# EasyEDA Pro project e_oct_dice_Dec_2022.eprj, board e_oct_dice_pcb_v0_2_alpha
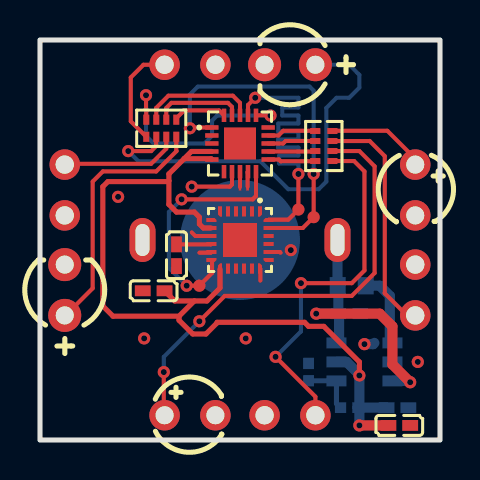
[diagram p7: board, top side]
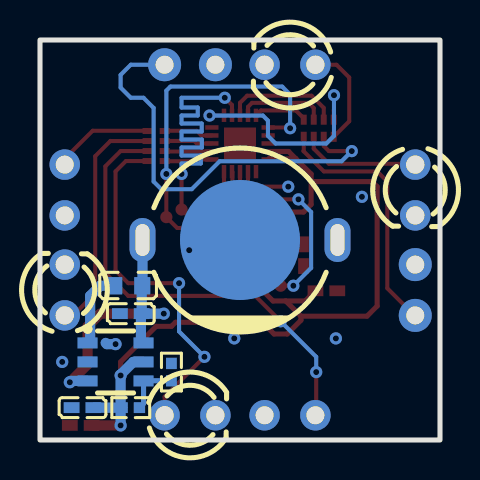
[diagram p8: board, bottom side, seen from below]

Outline 20 x 20 mm; copper layers: Top Layer, Bottom Layer. Coordinates in mm from the lower left corner of the outline.
Outline path: rectangle 0,20 20,0
Stack: Top Layer 0.035mm / Dielectric1 1.51mm FR4 er 4.5 / Bottom Layer 0.035mm

## Design rules (mm)
net LED_DEN: LED
net LED_CYR: LED
net LED_GEO: LED
net LED_WLD: LED
net LED_PYR: LED
net LED_HYD: LED
net LED_ANE: LED
net LED_ELE: LED
spacing safeClearance (default): track to track 0.152, other pairs 0.152 to 0.3
track width trackWidth (default): min 0.127, default 0.203, max 2.54
differential pair differentialPair (default): width min 0.127, default 0.254, max 2.54; gap min 0.152, default 0.152
via viaSize (default): diameter min 0.5, default 0.61, max 10; hole min 0.3, default 0.305, max 6

## Placement (name value [footprint] x y rotation side)
BT1  MY-927-01  [BAT-TH_MY-927-01]  10 10 180 bottom
C1  4.7uF  [C0402]  15.46 6.32 0 bottom
C2  4.7nF  [C0402]  17.87 1.62 180 bottom
C3  100nF  [C0402_NEW]  6.82 9.24 270 top
C4  10nF  [C0402]  17.96 0.73 0 top
C5  100nF  [C0402_NEW]  5.68 7.46 180 top
L1  4.7uH  [L0603]  15.59 7.71 180 bottom
LED1  204-10SURD/S530-A3-L  [LED-TH_BD3.0-P2.54-FD]  7.5 18.76 0 bottom
LED2  204-10SUBC/S400-A4  [LED-TH_BD4.0-P2.54-FD]  12.5 18.76 180 top
LED3  204-10SUGD/S400-A5  [LED-TH_BD3.0-P2.54-FD]  1.24 12.5 270 bottom
LED4  204-10SUBC/S400-A4  [LED-TH_BD4.0-P2.54-FD]  1.24 7.5 90 top
LED5  204-10SYGD/S530-E3-L  [LED-TH_BD3.0-P2.54-FD]  12.5 1.24 180 bottom
LED6  XL-302UWC  [LED-TH_BD3.8-P2.54-FD_WHITE]  7.5 1.24 0 top
LED7  TJ-L3FYTXHAMCGLFLC0A-A5  [LED-TH_BD3.0-P2.54-FD]  18.76 7.5 90 bottom
LED8  XL-302UWC  [LED-TH_BD3.8-P2.54-FD_WHITE]  18.76 12.5 270 top
NOREF  -  [Pad_e193]  10 12.67 0 top
NOREF#2  -  [Pad_e513]  13.68 11.14 0 top
NOREF#3  -  [Pad_e514]  12.92 11.52 0 top
NOREF#4  -  [Pad_e516]  7.97 7.71 0 top
NOREF#5  -  [Pad_e199]  10.38 12.67 0 top
PR1  TPS61070DDCR  [SOT-23-6_L2.9-W1.6-P0.95-LS2.8-BR]  16.22 3.9 0 bottom
R1  1MΩ  [R0402]  15.46 1.62 0 bottom
R2  180kΩ  [R0402]  13.43 3.4 270 bottom
RN1  220Ω  [RES-ARRAY-SMD_0402-8P-L2.0-W1.0-BL]  6.06 15.59 0 top
RN2  220Ω  [RES-ARRAY-SMD_0402-8P-L2.0-W1.0-BL]  14.19 14.7 90 top
U1  STC8G1K08-38I-QFN20  [TQFN-20L_L3.0-W3.0-P0.40-BL-EP]  10 14.83 270 top
U2  MPU6500  [QFN-24_L3.0-W3.0-P0.40-BL-EP]  10 10 180 top

## Footprints (pads in the part's own frame, mm; a bottom-side part is the same pattern mirrored in y, then rotated)
BAT-TH_MY-927-01
  oval 1.3x2.2 hole 0.701x1.6: 1(-4.875,0) 1(4.875,0)
  round 6 smd: 2(0,0)
C0402
  rect 0.79x0.54 smd: 1(-0.545,0) 2(0.545,0)
C0402_NEW
  rect 0.79x0.54 smd: 1(-0.545,0) 2(0.545,0)
L0603
  rect 0.8x0.864 smd: 1(-0.7,0) 2(0.7,0)
LED-TH_BD3.0-P2.54-FD
  round 1.524 hole 0.914: 1(-1.27,0) 2(1.27,0)
LED-TH_BD3.8-P2.54-FD_WHITE
  round 1.524 hole 0.9: 1(-1.27,0) 2(1.27,0)
LED-TH_BD4.0-P2.54-FD
  round 1.651 hole 0.9: 1(-1.27,0) 2(1.27,0)
Pad_e193
  custom 0.127x0.381 smd: 1(0,0)
Pad_e199
  custom 0.127x0.381 smd: 2(0,0)
Pad_e513
  round 0.61 smd: TP1(0,0)
Pad_e514
  round 0.61 smd: TP2(0,0)
Pad_e516
  round 0.61 smd: TP3(0,0)
QFN-24_L3.0-W3.0-P0.40-BL-EP
  custom 0.2x0.506 smd: 1(-1,-1.427) 6(1,-1.427) 13(1,1.427) 18(-1,1.427)
  rect 0.2x0.505 smd: 2(-0.6,-1.427) 3(-0.2,-1.427) 4(0.2,-1.427) 5(0.6,-1.427) 14(0.6,1.427) 15(0.2,1.427) 16(-0.2,1.427) 17(-0.6,1.427)
  custom 0.506x0.2 smd: 7(1.427,-1) 12(1.427,1) 19(-1.427,1) 24(-1.427,-1)
  rect 0.505x0.2 smd: 8(1.427,-0.6) 9(1.427,-0.2) 10(1.427,0.2) 11(1.427,0.6) 20(-1.427,0.6) 21(-1.427,0.2) 22(-1.427,-0.2) 23(-1.427,-0.6)
  rect 1.7x1.7 smd: 25(0,0)
R0402
  rect 0.566x0.54 smd: 1(-0.433,0) 2(0.433,0)
RES-ARRAY-SMD_0402-8P-L2.0-W1.0-BL
  rect 0.3x0.505 smd: 1(-0.75,0.427) 2(-0.25,0.427) 3(0.25,0.427) 4(0.75,0.427) 5(0.75,-0.427) 6(0.25,-0.427) 7(-0.25,-0.427) 8(-0.75,-0.427)
SOT-23-6_L2.9-W1.6-P0.95-LS2.8-BR
  rect 1x0.55 smd: 1(1.4,-0.95) 2(1.4,0) 3(1.4,0.95) 4(-1.4,0.95) 5(-1.4,0) 6(-1.4,-0.95)
TQFN-20L_L3.0-W3.0-P0.40-BL-EP
  rect 0.224x0.665 smd: 1(-0.8,-1.407) 2(-0.4,-1.407) 3(0,-1.407) 4(0.4,-1.407) 5(0.8,-1.407) 11(0.8,1.407) 12(0.4,1.407) 13(0,1.407) 14(-0.4,1.407) 15(-0.8,1.407)
  rect 0.665x0.224 smd: 6(1.407,-0.8) 7(1.407,-0.4) 8(1.407,0) 9(1.407,0.4) 10(1.407,0.8) 16(-1.407,0.8) 17(-1.407,0.4) 18(-1.407,0) 19(-1.407,-0.4) 20(-1.407,-0.8)
  rect 1.6x1.6 smd: 21(0,0)

## Nets
GND: BT1.2 C1.2 C2.1 C3.2 C4.2 C5.2 LED1.2 LED2.2 LED3.2 LED4.2 LED5.2 LED6.2 LED7.2 LED8.2 PR1.2 R2.1 U1.7 U2.9 U2.11 U2.18 U2.20
VBAT: C1.1 L1.2 PR1.3 PR1.6
VCC: C2.2 C4.1 C5.1 PR1.5 R1.2 U1.4 U1.5 U2.8 U2.13
LED_ANE: RN1.3 U1.19
LED_CYR: RN2.2 U1.12
LED_DEN: RN2.1 U1.11
LED_ELE: RN1.4 U1.20
LED_GEO: RN2.3 U1.13
LED_HYD: RN1.2 U1.18
LED_PYR: RN1.1 U1.16
LED_WLD: RN2.4 U1.14
MPU_INT: NOREF#4.TP3 U1.10 U2.12
MPU_SCL: NOREF#2.TP1 U1.1 U2.23
MPU_SDA: NOREF#3.TP2 U1.17 U2.24
RX: NOREF.1 U1.8
TX: NOREF#5.2 U1.9
$1N1768: L1.1 PR1.1
$1N1911: PR1.4 R1.1 R2.2
$1N2923: C3.1 U2.10
$1N6086: LED5.1 RN2.8
$1N6099: LED6.1 RN2.7
$1N6112: LED7.1 RN2.6
$1N6141: LED8.1 RN2.5
$1N6202: LED1.1 RN1.8
$1N6215: LED2.1 RN1.7
$1N6228: LED3.1 RN1.6
$1N6241: LED4.1 RN1.5

Pads without a net: BT1 1; U1 2 3 6 15 21; U2 1 2 3 4 5 6 7 14 15 16 17 19 21 22 25

## Via types
v1: diameter 0.61, hole 0.305, Top Layer to Bottom Layer, 22 vias
v2: diameter 0.61, hole 0.304, Top Layer to Bottom Layer, 2 vias

## Routing (per net, layer and track width the routed paths; a pad name or vN(x,y) marks a point on that pad's centre or on a via; arc(x,y) is an arc through that point)
GND: length 6.1
  Top Layer w0.203: U2.11 8.54,9.36 7.97,9.36 ; U2.18 11.02,8.56 11.02,7.97 ; 12.03,9.36 12,9.4 U2.20 ; U1.7 9.6,12.78 9.49,12.67 v1(7.59,12.67) ; U2.9 7.77,10.2 7.59,10.38
  Bottom Layer w0.508: v1(16.22,4.79) 16.66,4.79 16.72,4.85
  vias: v1(3.9,12.16) v1(12.54,9.49) v1(18.89,3.9) v2(5.21,5.08) v2(10.29,5.08)
VBAT: length 14.5
  Top Layer w0.508: v1(18.51,2.89) 17.62,3.78 17.62,5.68 16.99,6.32 v1(13.81,6.32)
  Bottom Layer w0.508: 14.87,10 14.87,7.73 L1.2 14.92,7.69 C1.1 ; v1(18.51,2.89) 18.44,2.95 PR1.3 ; C1.1 14.95,6.28 14.95,4.98 PR1.6 ; C1.1 v1(13.81,6.32)
VCC: length 45.2
  Top Layer w0.254: v1(15.97,3.23) 15.97,3.9 14.19,5.68 13.43,5.68 13.23,5.89 8.86,5.89 8.86,5.86 8.3,5.3 7.64,5.3 6.95,5.99 6.95,6.19 ; U1.4 7.57,14.43 7.21,14.06 ; U2.13 9,7.6 8.35,6.95 7.71,6.95 ; 7.21,14.06 8.55,14.06 U1.5 ; 7.21,14.06 6.44,13.3 6.44,12.96 ; 6.95,6.19 7.71,6.95 ; 6.95,6.19 3.65,6.19 3.14,6.7 3.14,12.67 3.4,12.92 6.4,12.92 6.44,12.96 ; 7.71,6.95 6.74,6.95 6.23,7.46 ; 6.44,12.96 6.44,11.78 6.82,11.4 7.71,11.4 7.97,11.14 7.97,10.8 8.17,10.6 U2.8
  Top Layer w0.508: v1(15.97,0.73) C4.1
  Bottom Layer w0.508: v1(15.97,0.73) 15.97,1.54 R1.2 ; R1.2 C2.2 ; R1.2 15.97,1.69 15.97,3.27 15.33,3.9 PR1.5
LED_ANE: length 4.5
  Top Layer w0.203: U1.19 9.6,16.66 9.4,16.86 6.57,16.86 6.31,16.6 RN1.3
LED_CYR: length 2.4
  Top Layer w0.203: U1.12 13.74,14.43 RN2.2
LED_DEN: length 2.4
  Top Layer w0.203: RN2.1 13.75,13.94 12.03,13.94 11.94,14.03 U1.11
LED_ELE: length 2.7
  Top Layer w0.203: U1.20 8.96,16.48 7.21,16.48 6.81,16.08 RN1.4
LED_GEO: length 2.4
  Top Layer w0.203: RN2.3 13.76,14.95 12.29,14.95 12.16,14.83 U1.13
LED_HYD: length 5.8
  Top Layer w0.203: RN1.2 5.81,16.61 6.42,17.21 9.64,17.21 10,16.86 U1.18
LED_PYR: length 11.4
  Top Layer w0.203: v1(5.3,17.24) 5.3,16.48 5.31,16.47 RN1.1 ; v1(11.52,16.22) 11.51,16.23 U1.16
  Bottom Layer w0.203: v1(11.52,16.22) 8.86,16.22 8.6,15.97 8.6,15.21 8.22,14.83 5.68,14.83 5.3,15.21 v1(5.3,17.24)
LED_WLD: length 2.5
  Top Layer w0.203: U1.14 11.92,15.23 12.16,15.46 13.75,15.46 RN2.4
MPU_INT: length 12.2
  Top Layer w0.203: U1.10 10.8,12.2 10.63,12.03 v1(7.08,12.03) ; U2.12 8.6,8.97 8.6,8.35 NOREF#4.TP3 v1(7.33,7.71)
  Bottom Layer w0.203: v1(7.33,7.71) 6.44,8.6 6.44,11.4 v1(7.08,12.03)
MPU_SCL: length 18.1
  Top Layer w0.203: U1.1 7.53,15.63 v1(7.5,15.59) ; v1(13.68,13.3) NOREF#2.TP1 13.14,10.6 U2.23
  Bottom Layer w0.203: v1(7.5,15.59) 7.5,17.2 7.46,17.24 7.89,17.67 13.48,17.67 13.68,17.47 v1(13.68,13.3)
MPU_SDA: length 18.1
  Top Layer w0.203: U2.24 11.44,11.02 12.41,11.02 NOREF#3.TP2 v1(12.92,13.3) ; v1(10.76,17.11) 10.4,16.75 U1.17
  Bottom Layer w0.203: v1(10.76,17.11) 12.92,17.11 12.92,16.62 12.11,16.62 12.11,16.22 12.92,16.22 12.92,15.82 11.91,15.82 11.91,15.42 12.92,15.42 12.92,15.02 11.91,15.02 11.91,14.62 12.92,14.62 12.92,14.22 11.96,14.22 11.96,13.82 12.92,13.82 v1(12.92,13.3)
RX: length 0.8
  Top Layer w0.203: U1.8 NOREF.1
TX: length 0.8
  Top Layer w0.203: NOREF#5.2 10.38,13.4 U1.9
$1N1768: length 3.8
  Bottom Layer w0.508: L1.1 16.99,7.71 17.49,7.21 17.49,4.98 PR1.1
$1N1911: length 2.8
  Bottom Layer w0.254: R1.1 14.82,1.82 PR1.4 14.81,2.96 R2.2
$1N2923: length 1.8
  Top Layer w0.203: U2.10 8.56,9.78 C3.1
$1N6086: length 18.2
  Top Layer w0.203: RN2.8 15.7,13.95 16.22,13.43 16.22,8.48 15.59,7.84 v1(13.05,7.84) ; v1(11.78,4.16) 13.77,2.17 LED5.1
  Bottom Layer w0.203: v1(13.05,7.84) 13.05,5.43 v1(11.78,4.16)
$1N6099: length 23
  Top Layer w0.203: v1(7.97,5.94) 9.24,7.21 15.59,7.21 16.73,8.35 16.73,13.68 15.97,14.45 RN2.7 ; v1(6.19,3.4) 6.19,1.28 LED6.1
  Bottom Layer w0.203: v1(7.97,5.94) 6.19,4.16 v1(6.19,3.4)
$1N6112: length 11.8
  Top Layer w0.203: RN2.6 16.47,14.95 16.48,14.95 17.24,14.19 17.24,7.33 18.34,6.23 LED7.1
$1N6141: length 5
  Top Layer w0.203: 18.77,13.77 18.77,14.06 17.37,15.46 14.63,15.46 RN2.5
$1N6202: length 5.1
  Top Layer w0.203: RN1.8 4.54,15.93 4.54,18.13 5.17,18.76 6.12,18.76
$1N6215: length 21.6
  Top Layer w0.203: RN1.7 5.81,15.16 5.81,14.7 5.56,14.44 v1(4.41,14.44)
  Bottom Layer w0.203: v1(4.41,14.44) 4.92,13.94 11.02,13.94 12.41,12.54 13.94,12.54 14.32,12.92 14.32,16.6 14.83,17.11 15.46,17.11 15.97,17.62 15.97,18.25 15.46,18.76 LED2.1
$1N6228: length 6
  Top Layer w0.203: 1.21,13.77 1.25,13.81 5.56,13.81 6.31,14.57 RN1.6
$1N6241: length 12.8
  Top Layer w0.203: LED4.1 1.28,6.23 2.63,7.59 2.63,12.92 3.14,13.43 5.81,13.43 6.82,14.44 6.81,14.46 RN1.5

## Copper pours and planes (outline as drawn; the poured copper is in the pictures)
GND on Top Layer: 0.13,20 20.13,20 20.13,0 0.13,0
GND on Bottom Layer: 0,19.5 0.01,19.61 0.06,19.74 0.15,19.85 0.26,19.94 0.39,19.99 0.5,20 19.5,20 19.61,19.99 19.74,19.94 19.85,19.85 19.94,19.74 19.99,19.61 20,19.5 20,0.5 19.99,0.39 19.94,0.26 19.85,0.15 19.74,0.06 19.61,0.01 19.5,0 0.5,0 0.39,0.01 0.26,0.06 0.15,0.15 0.06,0.26 0.01,0.39 0,0.5
